# Altium schematic sheet Pamp.SchDoc
size A3; SheetNumber: 2; SheetTotal: 3
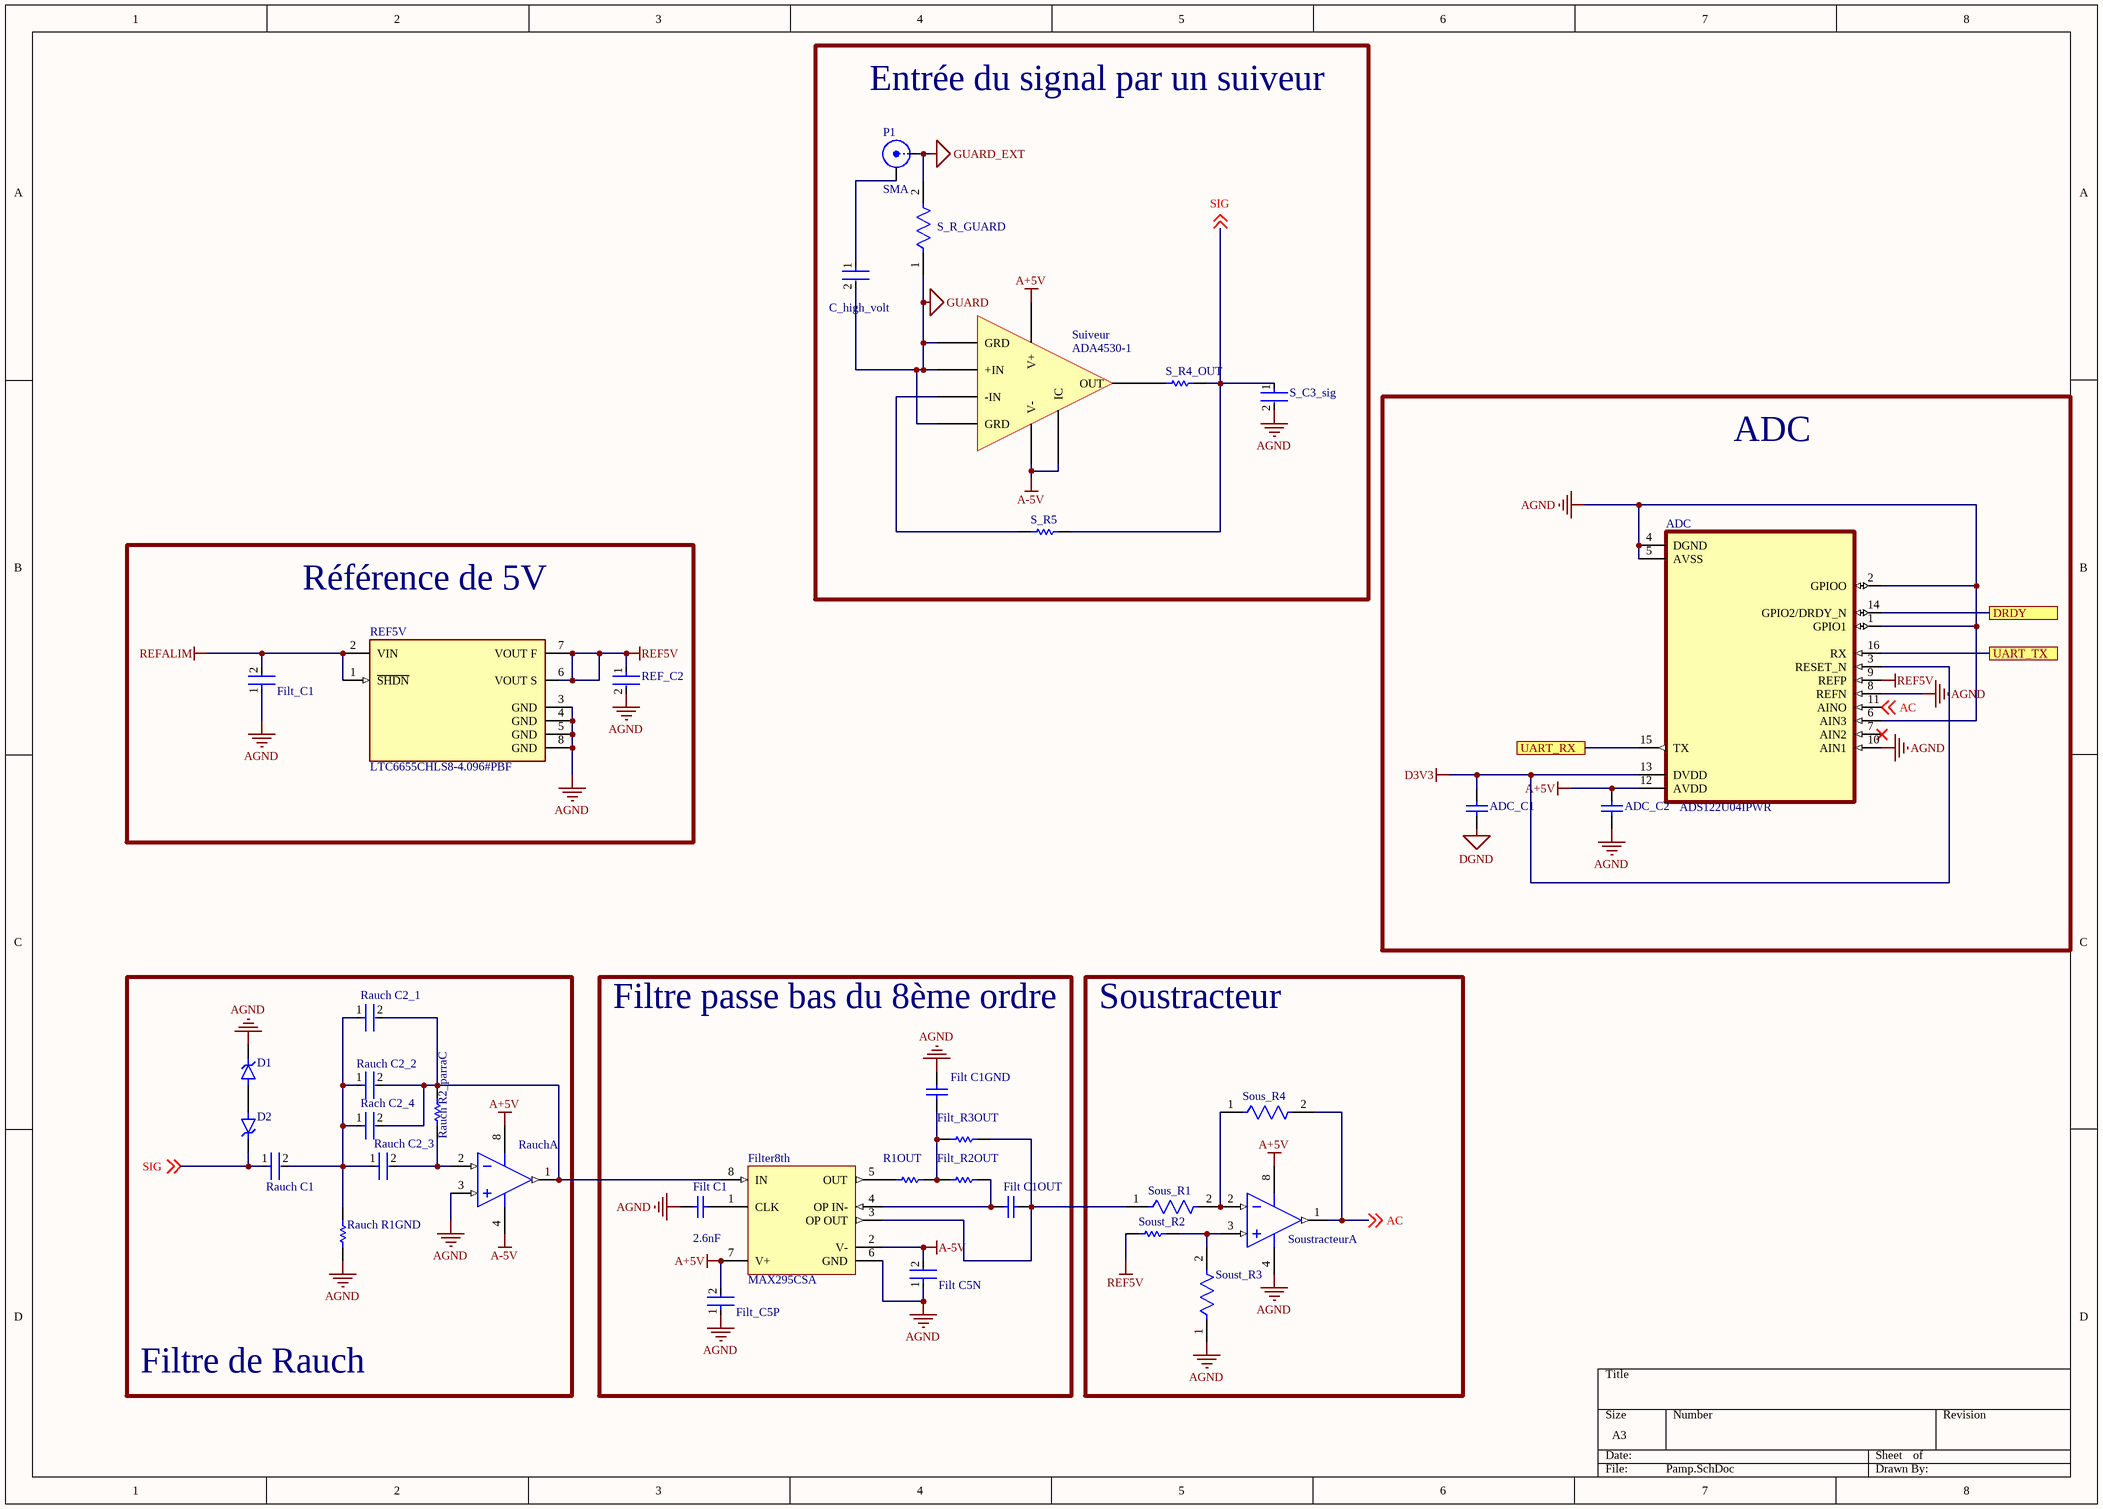
[diagram p0: Pamp.SchDoc]

## Parts
ADC  ADS122U04IPWR  [SOP65P640X120-16N]
ADC_C1  GRM216R71H103KA01D  [CAPC2013X70X45ML10T25]  (value not drawn)
ADC_C2  GRM216R71H103KA01D  [CAPC2013X70X45ML10T25]  (value not drawn)
C_high_volt  DE2B3SA331KA3BY02F  [FP-DE2_D6_T5_F7_5_d0_6-0-MFG]  (value not drawn)
D1  BZD27C200PWH  [PCBComponent_1]  (value not drawn)
D2  BZD27C200PWH  [PCBComponent_1]  (value not drawn)
Filt_C1  value 2.6nF  [1608[0603]]  (hidden comment: NPO/25V)
Filt_C1  C0805C104K5RACTU  [FP-C0805C-DN-MFG]  (value not drawn)
Filt_C1GND  NPO/25V  [1608[0603]]  (value not drawn)
Filt_C1OUT  NPO/25V  [1608[0603]]  (value not drawn)
Filt_C5N  C0805C104K5RACTU  [FP-C0805C-DN-MFG]  (value not drawn)
Filt_C5P  C0805C104K5RACTU  [FP-C0805C-DN-MFG]  (value not drawn)
Filt_R2OUT  RC0805FR-07100KL  [RESC2013X60X35ML10T20]  (value not drawn)
Filt_R3OUT  RC0805FR-07100KL  [RESC2013X60X35ML10T20]  (value not drawn)
Filter8th  MAX295CSA  [MAXM-S8-5_M]
P1  SMA  [SMB_V-RJ45]
R1OUT  RC0805FR-07100KL  [RESC2013X60X35ML10T20]  (value not drawn)
Rach_C2_4  GRM3195C1H203JA01D  [FP-GRM319-0_15-IPC_C]  (value not drawn)
Rauch  AD8642ARMZ  [ADI-RM-8_M]  (value not drawn)  (part A of 2)
Rauch_C1  C0805C104K5RACTU  [FP-C0805C-DN-MFG]  (value not drawn)
Rauch_C2_1  C0805C223K5RACTU  [FP-C0805C-DN-MFG]  (value not drawn)
Rauch_C2_2  C0805C104K5RACTU  [FP-C0805C-DN-MFG]  (value not drawn)
Rauch_C2_3  GRM55DR72E105KW01L  [FP-GRM55D-0_4-MFG]  (value not drawn)
Rauch_R1GND  RC0805FR-07100KL  [RESC2013X60X35ML10T20]  (value not drawn)
Rauch_R2_parraC  ERJ-6ENF2003V  [RESC2013X70X40LL20T20]  (value not drawn)
REF5V  LTC6655CHLS8-4.096#PBF  [FP-LS8-8-05-08-1852-MFG]
REF_C2  C0805C106K8PACTU  [FP-C0805C-DG-MFG]  (value not drawn)
S_C3_sig  CL31C221JGFNNNF  [FP-CL31-IPC_C]  (value not drawn)
S_R4_OUT  CRCW08051K00FKEA  [RESC2013X50X30NL20T20]  (value not drawn)
S_R5  ERJ-6ENF1500V  [RESC2013X70X40LL20T20]  (value not drawn)
S_R_GUARD  CRCW0805100KFKEA  [FP-CRCW0805-e3-MFG]  (value not drawn)
Sous_R1  CRCW0805240KFKEA  [FP-CRCW0805-e3-IPC_A]  (value not drawn)
Sous_R4  CRCW1206150KFKEA  [FP-CRCW1206-e3-MFG]  (value not drawn)
Soust_R2  ERA8AEB274V  [RESC3216X70X50LL20T25]  (value not drawn)
Soust_R3  CRCW0805120KFKEA  [FP-CRCW0805-e3-IPC_A]  (value not drawn)
Soustracteur  AD8642ARMZ  [ADI-RM-8_M]  (value not drawn)  (part A of 2)
Suiveur  ADA4530-1  [SOIC127P600X175-8N]

## Blocks framed on the sheet
Entrée du signal par un suiveur: C_high_volt P1 S_C3_sig S_R4_OUT S_R5 S_R_GUARD Suiveur
ADC: ADC ADC_C1 ADC_C2
Référence de 5V: Filt_C1 REF5V REF_C2
Filtre de Rauch: D1 D2 Rach_C2_4 Rauch Rauch_C1 Rauch_C2_1-Rauch_C2_3 Rauch_R1GND Rauch_R2_parraC
Filtre passe bas du 8ème ordre: Filt_C1 Filt_C1GND Filt_C1OUT Filt_C5N Filt_C5P Filt_R2OUT Filt_R3OUT Filter8th R1OUT
Soustracteur: Sous_R1 Sous_R4 Soust_R2 Soust_R3 Soustracteur

## Ports
DRDY, UART_RX, UART_TX

## Nets
A+5V: ADC.12(AVDD) ADC_C2.2 Filt_C5P.2 Filter8th.7(V+) Rauch.8(+V) Soustracteur.8(+V) Suiveur.5(V+)
A-5V: Filt_C5N.2 Filter8th.2(V-) Rauch.4(-V) Suiveur.3(IC) Suiveur.4(V-)
AGND: ADC.1(GPIO1) ADC.2(GPIOO) ADC.4(DGND) ADC.5(AVSS) ADC.6(AIN3) ADC.8(REFN) ADC.10(AIN1) ADC_C2.1 D1.C(K) Filt_C1.1 Filt_C1.2 Filt_C1GND.1 Filt_C5N.1 Filt_C5P.1 Filter8th.6(GND) Rauch.3(+IN_A) Rauch_R1GND.1 REF5V.3(GND) REF5V.4(GND) REF5V.5(GND) REF5V.8(GND) REF_C2.2 S_C3_sig.2 Soust_R3.1 Soustracteur.4(-V)
D3V3: ADC.3(RESET_N) ADC.13(DVDD) ADC_C1.2
DGND: ADC_C1.1
GUARD: C_high_volt.2 S_R_GUARD.1 Suiveur.1(+IN) Suiveur.2(GRD) Suiveur.7(GRD)
GUARD_EXT: P1.1(X) S_R_GUARD.2
REF5V: ADC.9(REFP) REF5V.6(VOUT_S) REF5V.7(VOUT_F) REF_C2.1 Soust_R2.1
REFALIM: Filt_C1.2 REF5V.1(~{SHDN}) REF5V.2(VIN)
AC: ADC.11(AINO) Sous_R4.2 Soustracteur.1(OUT_A) ; off-sheet AC
DRDY: ADC.14(GPIO2/DRDY_N) ; port DRDY
SIG: D2.C(K) Rauch_C1.1 S_C3_sig.1 S_R4_OUT.2 S_R5.2 ; off-sheet SIG
UART_RX: ADC.15(TX) ; port UART_RX
UART_TX: ADC.16(RX) ; port UART_TX
NetC_high_volt_1: C_high_volt.1 P1.2(Y)
NetD1_A: D1.A D2.A
NetFilt_C1_1: Filt_C1.1 Filter8th.1(CLK)
NetFilt_C1GND_2: Filt_C1GND.2 Filt_R2OUT.1 Filt_R3OUT.1 R1OUT.2
NetFilt_C1OUT_1: Filt_C1OUT.1 Filt_R2OUT.2 Filter8th.4(OP_IN-)
NetFilt_C1OUT_2: Filt_C1OUT.2 Filt_R3OUT.2 Filter8th.3(OP_OUT) Sous_R1.1
NetFilter8th_5: Filter8th.5(OUT) R1OUT.1
NetFilter8th_8: Filter8th.8(IN) Rach_C2_4.2 Rauch.1(OUT_A) Rauch_C2_1.2 Rauch_C2_2.2 Rauch_R2_parraC.2
NetRach_C2_4_1: Rach_C2_4.1 Rauch_C1.2 Rauch_C2_1.1 Rauch_C2_2.1 Rauch_C2_3.1 Rauch_R1GND.2
NetRauch_2: Rauch.2(-IN_A) Rauch_C2_3.2 Rauch_R2_parraC.1
NetS_R4_OUT_1: S_R4_OUT.1 Suiveur.6(OUT)
NetS_R5_1: S_R5.1 Suiveur.8(-IN)
NetSous_R1_2: Sous_R1.2 Sous_R4.1 Soustracteur.2(-IN_A)
NetSoust_R2_2: Soust_R2.2 Soust_R3.2 Soustracteur.3(+IN_A)

Not connected (* = marked no-connect by the designer): ADC 7(AIN2)*

## Library data of the parts
ADC_C1 ADC_C2 = CMP-2000-05013-1: Chip Capacitor, 10 nF, +/- 10%, 50 V, -55 to 125 degC, 0805 (2012 Metric), RoHS, Tape and Reel; Manufacturer: Murata; Voltage Rating DC: 50V; Capacitance: 0.01uF; Temperature Coefficient / Code: +/-15%; Capacitance - pF: 10000pF; Case Height: 0.6mm; Dielectric: X7R; Case Length: 2mm; Case Width: 1.25mm; Brand: MurataElectronics; Capacitance - nF: 10nF; Tolerance: 10%; Product Category: MultilayerCeramicCapacitorsMLCC-SMD/SMT; Minimum Operating Temperature: -55C; Voltage Rating: 50V; Series: GRM; Packaging: Reel; Dimensions: 1.25mmWx2mmLx0.6mmH; Operating Temperature Range: -55Cto+125C; Package / Case: 0805(2012metric); Datasheet URL: https://datasheet.ciiva.com/29201/452521-da-01-en-vs-kondensator-0805-29201121.pdf; Maximum Operating Temperature: +125C; Factory Pack Quantity: 4000; Case Code - in: 0805; Case Code - mm: 2012; Manufacturer URL: http://www.murata.com/; Termination Style: SMD/SMT; Type: GeneralPurposeMLCC; Datasheet Version: Dec-10; RoHS: Details; Product: GeneralTypeMLCCs
C_high_volt = CMP-06035-062106-1: Cap Ceramic Disc 330pF 10% 400VAC Thru-Hole 6.0x5.0x7.5 Bulk
Filt_C1 Filt_C1GND Filt_C1OUT = Cap Semi: Capacitor (Semiconductor SIM Model); Published: 8-Jun-2000; LatestRevisionDate: 29-May-2009; LatestRevisionNote: IPC-7351 Footprint Added.; PackageReference: C1206; Publisher: Altium Limited; PackageDescription: Chip Capacitor
Filt_C1 Filt_C5N Filt_C5P Rauch_C2_2 = CMP-2007-00279-2: CAP CER 0.1UF 50V X7R 0805; Manufacturer: KEMET; Value: 0.10 μF; Description: C0805 0.10 μF X7R 30ppm/°C 10.00% 50 V; Tolerance: 0.1; Temperature Coefficient: 30ppm/°C; Manufacturer Part Number: C0805C104K5RACTU; Device Class L2: Capacitors; Temperature Range Low: -55°C; Voltage Rating: 50 V; Digikey Description: CAP CER 0.1UF 50V X7R 0805; Category: Cap; ComponentLink2Description: Datasheet; Octopart: https://octopart.com/c0805c104k5ractu-kemet-143926; RoHS: TRUE; ComponentLink2URL: https://content.kemet.com/datasheets/KEM_C1003_C0G_SMD.pdf; Temperature Characteristic: X7R; Temperature: -55°C to +125°C; Height: 0.88mm; Temperature Range High: +125°C; Device Class L1: Passive Components; Automotive: No; Lead Free: Yes; Ipc Land Pattern Name: CAPC200125X78; Material: Ceramic; Device Class L3: Ceramic Capacitors; Mouser Description: Cap Ceramic 0.1uF 50V X7R 10% SMD 2.0 x 1.2 mm 125 C Paper T/R; Capacitance: 0.10 μF; Package: C0805C-DN
Filt_R2OUT Filt_R3OUT R1OUT Rauch_R1GND = CMP-2100-03668-1: Chip Resistor, 100 KOhm, +/- 1%, 0.125 W, -55 to 155 degC, 0805 (2012 Metric), RoHS, Tape and Reel; Manufacturer: Yageo; Max Power Dissipation: 125mW; Voltage Rating: 150V; Temperature Coefficient: 100ppm/degreesC; Manufacturer URL: http://www.yageo.com/; Min Operating Temperature: -55degC; Lead Pitch: 0.4mm; Composition: ThickFilm; Case Code (Metric): 2012; Military Standard: Not; Package Description: 2-Pin Surface Mounted Device, Body 2 x 1.25 mm; REACH SVHC: Unknown; RoHSCompliant: true; Depth: 1.25mm; Number of Pins: 2; Lead Free: LeadFree; Resistance: 100KOhm; Datasheet URL: http://www.yageo.com/NewPortal/yageodocoutput?fileName=/pdf/R-Chip/PYu-RC_Group_51_RoHS_L_5.pdf; Max Operating Temperature: 155degC; Case/Package: 0805; Package Quantity: 1; Case Code (Imperial): 0805; Power Rating: 125mW; Width: 0.049inch; Package Reference: 0805; Height: 0.024inch; Termination: SMD/SMT; Tolerance: 1%; Datasheet Version: Rev. 5, 10/2016; Length: 2mm; Voltage Rating (DC): 150V; Number of Terminations: 2; Packaging: TapeandReel
Filter8th = CMP-0026-00196-2: 8th-Order Switched Capacitor Lowpass Filter, Butterworth, Clock Tunable, 0 to 70 degC, 8-Pin SOIC (S8-5); Generic Part Number: MAX295; Filter Sections: 1; Order Per Filter Section: 8; ComponentLink3URL: http://pdfserv.maximintegrated.com/package_dwgs/21-0041.PDF; Filter Characteristic: Butterworth; DatasheetVersion: Rev. 5; Code_JEDEC: MS012; ComponentLink3Description: Package Specification; ComponentLink2URL: http://datasheets.maximintegrated.com/en/ds/MAX291-MAX296.pdf; ComponentLink1URL: http://www.maximintegrated.com/; Mounting Technology: Surface Mount; PartNumber: MAX295CSA; PackageReference: S8-5; Filter Class: Switched Cap; PackageDescription: 8-Pin Small-Outline IC, Narrow (0.15in) (S8-5), Body 4.90 x 3.90 mm, Pitch 1.27 mm; Filter Type: Lowpass; ComponentLink1Description: Manufacturer URL; PackageVersion: Rev. D, 10/2012; Program Method: Clock; ComponentLink2Description: Datasheet
P1 = SMB: SMA 90deg ConnectorR125680000; LatestRevisionDate: 17-Jul-2002; LatestRevisionNote: Re-released for DXP Platform.; Publisher: Altium Limited
Rach_C2_4 = CMP-06035-011753-1: Chip Multilayer Ceramic Capacitors for General Purpose, 1206, 20000pF, C0G, 30ppm/°C, 5%, 50V; Capacitance: 20nF; Temperature Coefficient: 30ppm/°C; Radiation Hardening: No; Max Operating Temperature: 125°C; Packaging: Tape and Reel; Voltage: 50V; Case Code (Imperial): 1206; Tolerance: 5%; Length: 3.2mm; Termination: SMD/SMT; Voltage Rating (DC): 50V; Dielectric: C0G; Case/Package: 1206; Height: 0.85mm; Min Operating Temperature: -55°C; Lead Free: Lead Free; Mount: Surface Mount; Width: 0.063inch; Package Quantity: 1; Voltage Rating: 50V; Case Code (Metric): 3216; Depth: 1.6mm; Thickness: 0.037inch
Rauch Soustracteur = CMP-0384-01629-1: Double Channel Very Low Input Bias Current Operational Amplifier, 3.5 MHz BW, 3 V/us SR, Industrial, 8-pin SOP (RM-8), Tube; Manufacturer: Analog Devices; Generic Part Number: AD8642; Input Offset Voltage: 50uV; Small Signal Bandwidth: 3.5MHz; Iq/Amp: 290uA; Input Bias Current: 250fA; V Span Min: 5V; V Span Max: 26V; Slew Rate: 3V/us; Amplifiers Per Package: 2; PackageReference: RM-8; ComponentLink1URL: http://www.analog.com/en/index.html; ComponentLink2URL: http://www.analog.com/static/imported-files/data_sheets/AD8641_8642_8643.pdf; ComponentLink3URL: http://www.analog.com/static/imported-files/packages/PKG_PDF/MSOP%28RM%29/RM_8.pdf; PackageDescription: 8-Pin Mini Small Outline Package, Body 3 x 3 mm, Pitch 0.65 mm; DatasheetVersion: Rev. E; Mounting Technology: Surface Mount; PartNumber: AD8642ARMZ; ComponentLink3Description: Package Specification; Code_JEDEC: MO-187-AA; ComponentLink1Description: Manufacturer URL; ComponentLink2Description: Datasheet
Rauch_C1 = CMP-2007-00279-2: CAP CER 0.1UF 50V X7R 0805; Manufacturer: KEMET; Value: 0.10 μF; Tolerance: 0.1; Temperature Coefficient: 30ppm/°C; Manufacturer Part Number: C0805C104K5RACTU; Device Class L2: Capacitors; Temperature Range Low: -55°C; Voltage Rating: 50 V; Digikey Description: CAP CER 0.1UF 50V X7R 0805; Category: Cap; ComponentLink2Description: Datasheet; Octopart: https://octopart.com/c0805c104k5ractu-kemet-143926; RoHS: TRUE; ComponentLink2URL: https://content.kemet.com/datasheets/KEM_C1003_C0G_SMD.pdf; Temperature Characteristic: X7R; Temperature: -55°C to +125°C; Height: 0.88mm; Temperature Range High: +125°C; Device Class L1: Passive Components; Automotive: No; Lead Free: Yes; Ipc Land Pattern Name: CAPC200125X78; Material: Ceramic; Device Class L3: Ceramic Capacitors; Mouser Description: Cap Ceramic 0.1uF 50V X7R 10% SMD 2.0 x 1.2 mm 125 C Paper T/R; Capacitance: 0.10 μF; Package: C0805C-DN
Rauch_C2_1 = CMP-2007-00338-2: CAP CER 0.022UF 50V X7R 0805; Manufacturer: KEMET; Value: 22,000 pF; Tolerance: 0.1; Temperature Coefficient: 30ppm/°C; Automotive: No; Package: C0805C-DN; RoHS: TRUE; Height: 0.88mm; Lead Free: Yes; Temperature Range Low: -55°C; Digikey Description: CAP CER 0.022UF 50V X7R 0805; ComponentLink2Description: Datasheet; Capacitance: 22,000 pF; Mouser Description: Capacitor; Ceramic; Cap; .022uF; Tol 10%; SMT; Vol-Rtg 50V; X7R; Tape and Reel; Device Class L3: Ceramic Capacitors; Category: Cap; Voltage Rating: 50 V; Temperature Characteristic: X7R; Ipc Land Pattern Name: CAPC200125X78; Manufacturer Part Number: C0805C223K5RACTU; Octopart: https://octopart.com/c0805c223k5ractu-kemet-145968; Device Class L1: Passive Components; Temperature: -55°C to +125°C; Material: Ceramic; ComponentLink2URL: https://content.kemet.com/datasheets/KEM_C1003_C0G_SMD.pdf; Temperature Range High: +125°C; Device Class L2: Capacitors
Rauch_C2_3 = CMP-2000-06370-2: Chip Multilayer Ceramic Capacitors for General Purpose, 2220, 1.0uF, X7R, 15%, 10%, 250V; Capacitance: 1uF; Width: 5mm; Height: 2mm; Case Code (Imperial): 2220; Voltage Rating (DC): 250V; Max Operating Temperature: 125°C; Number of Pins: 2; Min Operating Temperature: -55°C; Termination: SMD/SMT; Case/Package: 2220; Dielectric: X7R; Material: Ceramic; REACH SVHC: No SVHC; Voltage: 250V; Packaging: Tape and Reel; Thickness: 0.087inch; Depth: 5mm; Package Quantity: 1; Tolerance: 10%; Mount: Surface Mount; Voltage Rating: 250V; Length: 5.7mm; Case Code (Metric): 5750; Lead Free: Lead Free
Rauch_R2_parraC = CMP-2001-00028-1: Manufacturer: Panasonic; Part Number: ERJ-6ENF2003V
REF5V = CMP-09137-000020-1: IC VREF SERIES 0.05% 8CLCC; Min Output Voltage: 4.096V; Temperature Coefficient: 5ppm/°C; Operating Supply Current: 7.5mA; Output Type: Fixed; Output Current: 5mA; Min Operating Temperature: -40°C; REACH SVHC: No SVHC; RoHS Compliant: Yes; Tolerance: 0.05%; Reference Type: Series; Mount: Surface Mount; Case/Package: CLCC; Packaging: Tray; Reference Voltage: 4.096V; Max Operating Temperature: 125°C; Number of Pins: 8; Package Quantity: 576
REF_C2 = CMP-2007-03243-2: CAP CER 10UF 10V X5R 0805; Manufacturer: Kemet; 3DS Part Number: 220-00001; Tolerance: 10%; Temperature Coefficient: 15%; Device Class L2: Capacitors; Device Class L1: Passive Components; ComponentLink2URL: https://content.kemet.com/datasheets/KEM_C1006_X5R_SMD.pdf; Height: 1.4mm; Lead Free: Yes; Manufacturer Part Number: C0805C106K8PACTU; Digikey Description: CAP CER 10UF 10V X5R 0805; Octopart: https://octopart.com/c0805c106k8pactu-kemet-98697; Capacitance: 10uF; Value: 10uF; Temperature Range Low: -55°C; Temperature: -55°C to +85°C; Automotive: No; Mouser Description: CAP CER 10UF 10V X5R 0805; Ipc Land Pattern Name: CAPC200125X125; Material: Ceramic; Temperature Range High: +85°C; Voltage: 10V; RoHS: TRUE; Device Class L3: Ceramic Capacitors; ComponentLink2Description: Datasheet; Voltage Rating: 10V; Package: C0805C-DG; Temperature Characteristic: X5R; Category: Cap
S_C3_sig = CMP-13271-001211-1: Cap Ceramic 220pF 500V C0G ±5% SMD 1206 +125°C Embossed T/R; Tolerance: 5%; Voltage Rating (DC): 500V; Depth: 1.6mm; Capacitance: 220pF; Max Operating Temperature: 125°C; Width: 0.063inch; Radiation Hardening: No; Thickness: 0.055inch; Packaging: Tape and Reel; Height: 1.25mm; Case/Package: 1206; Package Quantity: 10000; Dielectric: C0G; Mount: Surface Mount; Voltage Rating: 500V; Min Operating Temperature: -55°C; Length: 3.2mm
S_R4_OUT = CMP-1013-00510-2: Manufacturer: Vishay Dale; Part Number: CRCW08051K00FKEA
S_R5 = CMP-2001-04437-1: Manufacturer: Panasonic; Part Number: ERJ-6ENF1500V
S_R_GUARD = CMP-2001-04899-2: RES Thick Film, 100kΩ, 1%, 0.125W, 100ppm/°C, 0805; Resistance: 100kR; Power Rating: 125mW; Voltage Rating: 150V; Case/Package: 0805; Max Operating Temperature: 155°C; Case Code (Imperial): 0805; Lead Free: Lead Free; Weight: 0.000194oz; Number of Pins: 2; Package Quantity: 5000; Height: 0.45mm; Composition: Thick Film; Military Standard: Not; Tolerance: 1%; Case Code (Metric): 2012; Termination: SMD/SMT; Mount: Surface Mount; Radiation Hardening: No; Width: 1.25mm; Length: 2mm; Depth: 1.25mm; Packaging: Tape and Reel; Min Operating Temperature: -55°C; Contact Plating: Tin; Temperature Coefficient: 100ppm/°C; Voltage Rating (DC): 150V
Sous_R1 = CMP-2001-03703-2: RES Thick Film, 240kΩ, 1%, 0.125W, 100ppm/°C, 0805; Power Rating: 125mW; Voltage Rating: 150V; Resistance: 240kR; Height: 0.45mm; Military Standard: Not; Weight: 0.000194oz; Case/Package: 0805; Package Quantity: 5000; Packaging: Tape and Reel; Contact Plating: Tin; Case Code (Metric): 2012; Tolerance: 1%; Depth: 1.25mm; Case Code (Imperial): 0805; Temperature Coefficient: 100ppm/°C; Radiation Hardening: No; Width: 1.25mm; Min Operating Temperature: -55°C; Termination: SMD/SMT; Max Operating Temperature: 155°C; Composition: Thick Film; Length: 2mm
Sous_R4 = CMP-2003-01810-2: RES Thick Film, 150kΩ, 1%, 0.25W, 100ppm/°C, 1206; Max Power Dissipation: 250mW; Voltage Rating: 200V; Resistance: 150kR; Depth: 1.6mm; Length: 3.2mm; Power Rating: 250mW; Temperature Coefficient: 100ppm/°C; Military Standard: Not; Weight: 0.000353oz; Termination: SMD/SMT; Tolerance: 1%; Max Operating Temperature: 155°C; Contact Plating: Tin; Packaging: Tape and Reel; Package Quantity: 10; Width: 0.063inch; Case/Package: 1206; Number of Terminations: 2; Voltage Rating (DC): 200V; Case Code (Imperial): 1206; Min Operating Temperature: -55°C; Mount: Surface Mount; Case Code (Metric): 3216; Radiation Hardening: No; Composition: Thick Film; Height: 0.55mm; Features: Automotive AEC-Q200; Lead Free: Lead Free
Soust_R2 = CMP-2003-04449-1: Manufacturer: Panasonic; Part Number: ERA8AEB274V
Soust_R3 = CMP-2001-04928-2: RES Thick Film, 120kΩ, 1%, 0.125W, 100ppm/°C, 0805; Max Power Dissipation: 125mW; Resistance: 120kR; Voltage Rating: 150V; Width: 0.049inch; Depth: 1.25mm; Package Quantity: 10; Case Code (Imperial): 0805; Height: 0.45mm; Features: Automotive AEC-Q200; Temperature Coefficient: 100ppm/°C; Military Standard: Not; Radiation Hardening: No; Case Code (Metric): 2012; Max Operating Temperature: 155°C; Composition: Thick Film; Min Operating Temperature: -55°C; Power Rating: 125mW; Case/Package: 0805; Number of Terminations: 2; Contact Plating: Tin; Tolerance: 1%; Mount: Surface Mount; Lead Free: Lead Free; Weight: 0.000194oz; Voltage Rating (DC): 150V; Length: 2mm; Packaging: Tape and Reel; Termination: SMD/SMT
ADC = ADS122U04IPWR: Package: None; Price: None; Value: *; MP: ADS122U04IPWR; Availability: Unavailable